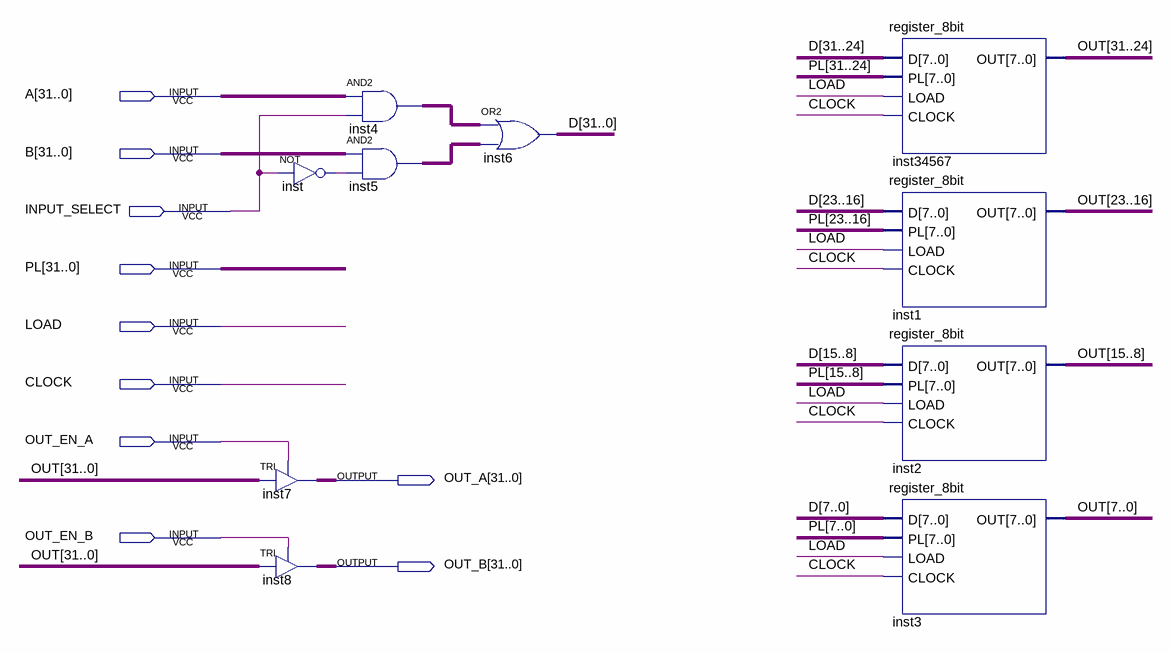
[diagram p0: schematic sheet]
// Quartus schematic registrador_32bits.bdf as structural Verilog: 10 symbols, 10 pins
module registrador_32bits (
  input  [31:0] A,
  input  [31:0] B,
  input  INPUT_SELECT,
  input  [31:0] PL,
  input  LOAD,
  input  CLOCK,
  input  OUT_EN_A,
  input  OUT_EN_B,
  output [31:0] OUT_A,
  output [31:0] OUT_B
);

  wire inst_out;
  wire [31:0] D, inst4_out, inst5_out, OUT;

  not inst (inst_out, INPUT_SELECT);
  TRI inst7[31:0] (.IN(OUT), .OE(OUT_EN_A), .OUT(OUT_A));
  TRI inst8[31:0] (.IN(OUT), .OE(OUT_EN_B), .OUT(OUT_B));
  assign inst4_out = A & {32{INPUT_SELECT}};  // AND2 inst4, 32 bits wide
  assign inst5_out = B & {32{inst_out}};  // AND2 inst5, 32 bits wide
  assign D = inst4_out | inst5_out;  // OR2 inst6, 32 bits wide
  register_8bit inst34567 (.D(D[31:24]), .PL(PL[31:24]), .LOAD(LOAD), .CLOCK(CLOCK), .OUT(OUT[31:24]));
  register_8bit inst1 (.D(D[23:16]), .PL(PL[23:16]), .LOAD(LOAD), .CLOCK(CLOCK), .OUT(OUT[23:16]));
  register_8bit inst2 (.D(D[15:8]), .PL(PL[15:8]), .LOAD(LOAD), .CLOCK(CLOCK), .OUT(OUT[15:8]));
  register_8bit inst3 (.D(D[7:0]), .PL(PL[7:0]), .LOAD(LOAD), .CLOCK(CLOCK), .OUT(OUT[7:0]));
endmodule
